# Altium schematic sheet KNX_POE.SchDoc
size A4
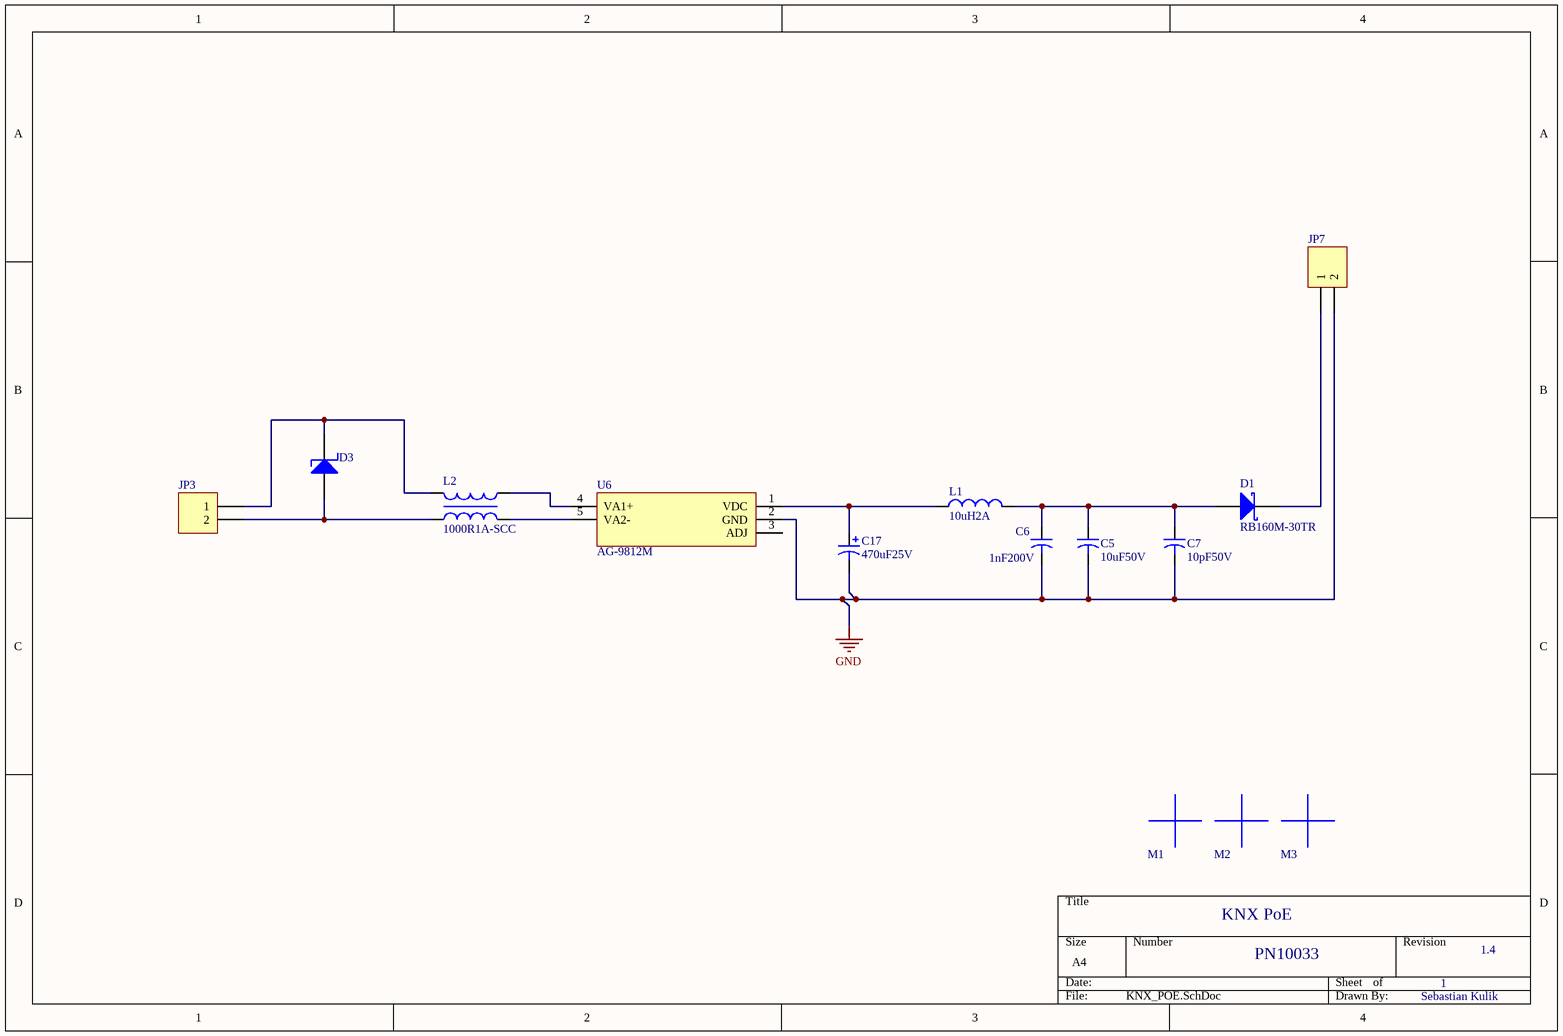
[diagram p0: KNX_POE.SchDoc]

## Parts
C5  value 10uF50V  [C1210]  (hidden comment: 10uF50V_1210)
C6  value 1nF200V  [C0603]  (hidden comment: 1nF200V_0603)
C7  value 10pF50V  [C0603]  (hidden comment: 10pF50V_0603)
C17  value 470uF25V  [Panasonic-FT-F_Case]  (hidden comment: 470uF25V_POL_FT)
D1  RB160M-30TR  [SOD123]
D3  SMAJ58A-E3/61  [DO214A]  (value not drawn)
JP3  Plug_2_90_2.54  [HDR1X2-down]  (value not drawn)
JP7  Plug_2_90_2.54  [HDR1X2-down]  (value not drawn)
L1  10uH2A  [WE-PD2_1]
L2  1000R1A-SCC  [WE-SCC_7345]
M1  Paste Mark  [Mark-3mm]  (value not drawn)
M2  Paste Mark  [Mark-3mm]  (value not drawn)
M3  Paste Mark  [Mark-3mm]  (value not drawn)
U6  AG-9812M  [Ag9812M]

## Nets
GND: C5.2 C6.2 C7.2 C17.2 JP7.2 U6.2(GND)
NetC5_1: C5.1 C6.1 C7.1 D1.2(A) L1.2
NetC17_1: C17.1 L1.1 U6.1(VDC)
NetD1_1: D1.1(K) JP7.1
NetD3_1: D3.1(K) JP3.1 L2.2
NetD3_2: D3.2(A) JP3.2 L2.1
NetL2_3: L2.3 U6.5(VA2-)
NetL2_4: L2.4 U6.4(VA1+)

Not connected (* = marked no-connect by the designer): U6 3(ADJ)

## Notes on the sheet
- KNX PoE
- PN10033
- 1
- 1.4
- Sebastian Kulik

## Library data of the parts
C5 = 10uF50V_1210: AVX,  X7R, 10%, 50V; Deliverer PartNr: 2094047RL; Manufacturer PartNr: 12105C106KAT2A; Deliverer: Farnell; TDE-PN: C0039; Published: 17.02.2014; Part Description: AVX,  X7R, 10%, 50V; Publisher: Sebastian Kulik; PackageDescription: C1210; Manufacturer: AVX
C6 = 1nF200V_0603: MLCC series, X7R, 10%, 200V; Deliverer PartNr: 1740637; Manufacturer: AVX; Manufacturer PartNr: 06032C102KAT2A; Deliverer: Farnell; TDE-PN: C0002; Published: 11.03.2014; Part Description: MLCC series, X7R, 10%, 200V; Publisher: Sebastian Kulik; PackageDescription: C0603
C7 = 10pF50V_0603: AVX ,  +-0.5pF, 50V; Deliverer PartNr: 2332595RL; Manufacturer PartNr: 06035A100DAT2A; Deliverer: Farnell; TDE-PN: C0033; Published: 13.02.2014; Part Description: AVX ,  +-0.5pF, 50V; Publisher: Sebastian Kulik; PackageDescription: C0603; Manufacturer: AVX
C17 = 470uF25V_POL_FT: Panasonic, FT series; Deliverer PartNr: 1868411; Manufacturer PartNr: EEEFT1E471AP; Deliverer: Farnell; TDE-PN: C0048; Published: 23.09.2014; Part Description: Panasonic, FT series; Publisher: Sebastian Kulik; PackageDescription: Panasonic-FT-F; Manufacturer: Panasonic
D1 = RB160M-30TR: Diode Schottky,2A,40V; Deliverer PartNr: 1525480; Manufacturer: Rohm; TDE-PN: DIS0010; Deliverer: Farnell; Published: 17.02.2014; Publisher: Sebastian Kulik; PackageDescription: SOD123; Manufacturer PartNr: RB160M-30TR
D3 = SMAJ58A-E3/61: TVS, 400W, 58V; Deliverer PartNr: 1837053; Manufacturer: Vishay; TDE-PN: DIS0009; Deliverer: Farnell; Published: 17.02.2014; Publisher: Sebastian Kulik; PackageDescription: DO214AC; Manufacturer PartNr: SMAJ58A-E3/61
JP3 JP7 = Plug_2_90_2.54: Plug, 2-Pin; Manufacturer PartNr: 61300211021; Manufacturer: WE; Deliverer PartNr: 2356176; Deliverer: Farnell; TDE-PN: CON0010; LatestRevisionDate: 14.05.2014; LatestRevisionNote: Re-released for DXP Platform.; Publisher: Sebastian Kulik
L1 = 10uH2A_WE-PD2: WE-PD2, 10uH2A; Deliverer PartNr: 1636035; Manufacturer: WE; Manufacturer PartNr: 74477510; Deliverer: Farnell; TDE-PN: P0017; Published: 17.02.2014; Publisher: Sebastian Kulik; Value: 10uH2A; PackageDescription: WE-PD2_1
L2 = 1000R1A-SCC: Common mode choke; Deliverer PartNr: 744281100; Deliverer: WE; TDE-PN: P0034; Manufacturer: WE; Manufacturer PartNr: 744281100; Published: 30.01.2015; Publisher: Sebastian Kulik; PackageDescription: WE-CMS; Value: 1000R1A-SCC
M1-M3 = Mark
U6 = AG-9812M: PoE, 12V; Manufacturer: Silvertel; TDE-PN: IC0052; Published: 17.02.2014; Deliverer PartNr: -; Deliverer: -; Publisher: Sebastian Kulik; Manufacturer PartNr: AG-9812M; PackageDescription: AG9812M